# Altium schematic sheet InputAmplifier.SchDoc
size Tabloid; DocumentNumber: 11; SheetNumber: 11; SheetTotal: 11; SheetName: Audio input amplifier; Size: 11x17; Sheet_Name: Audio input amplifier
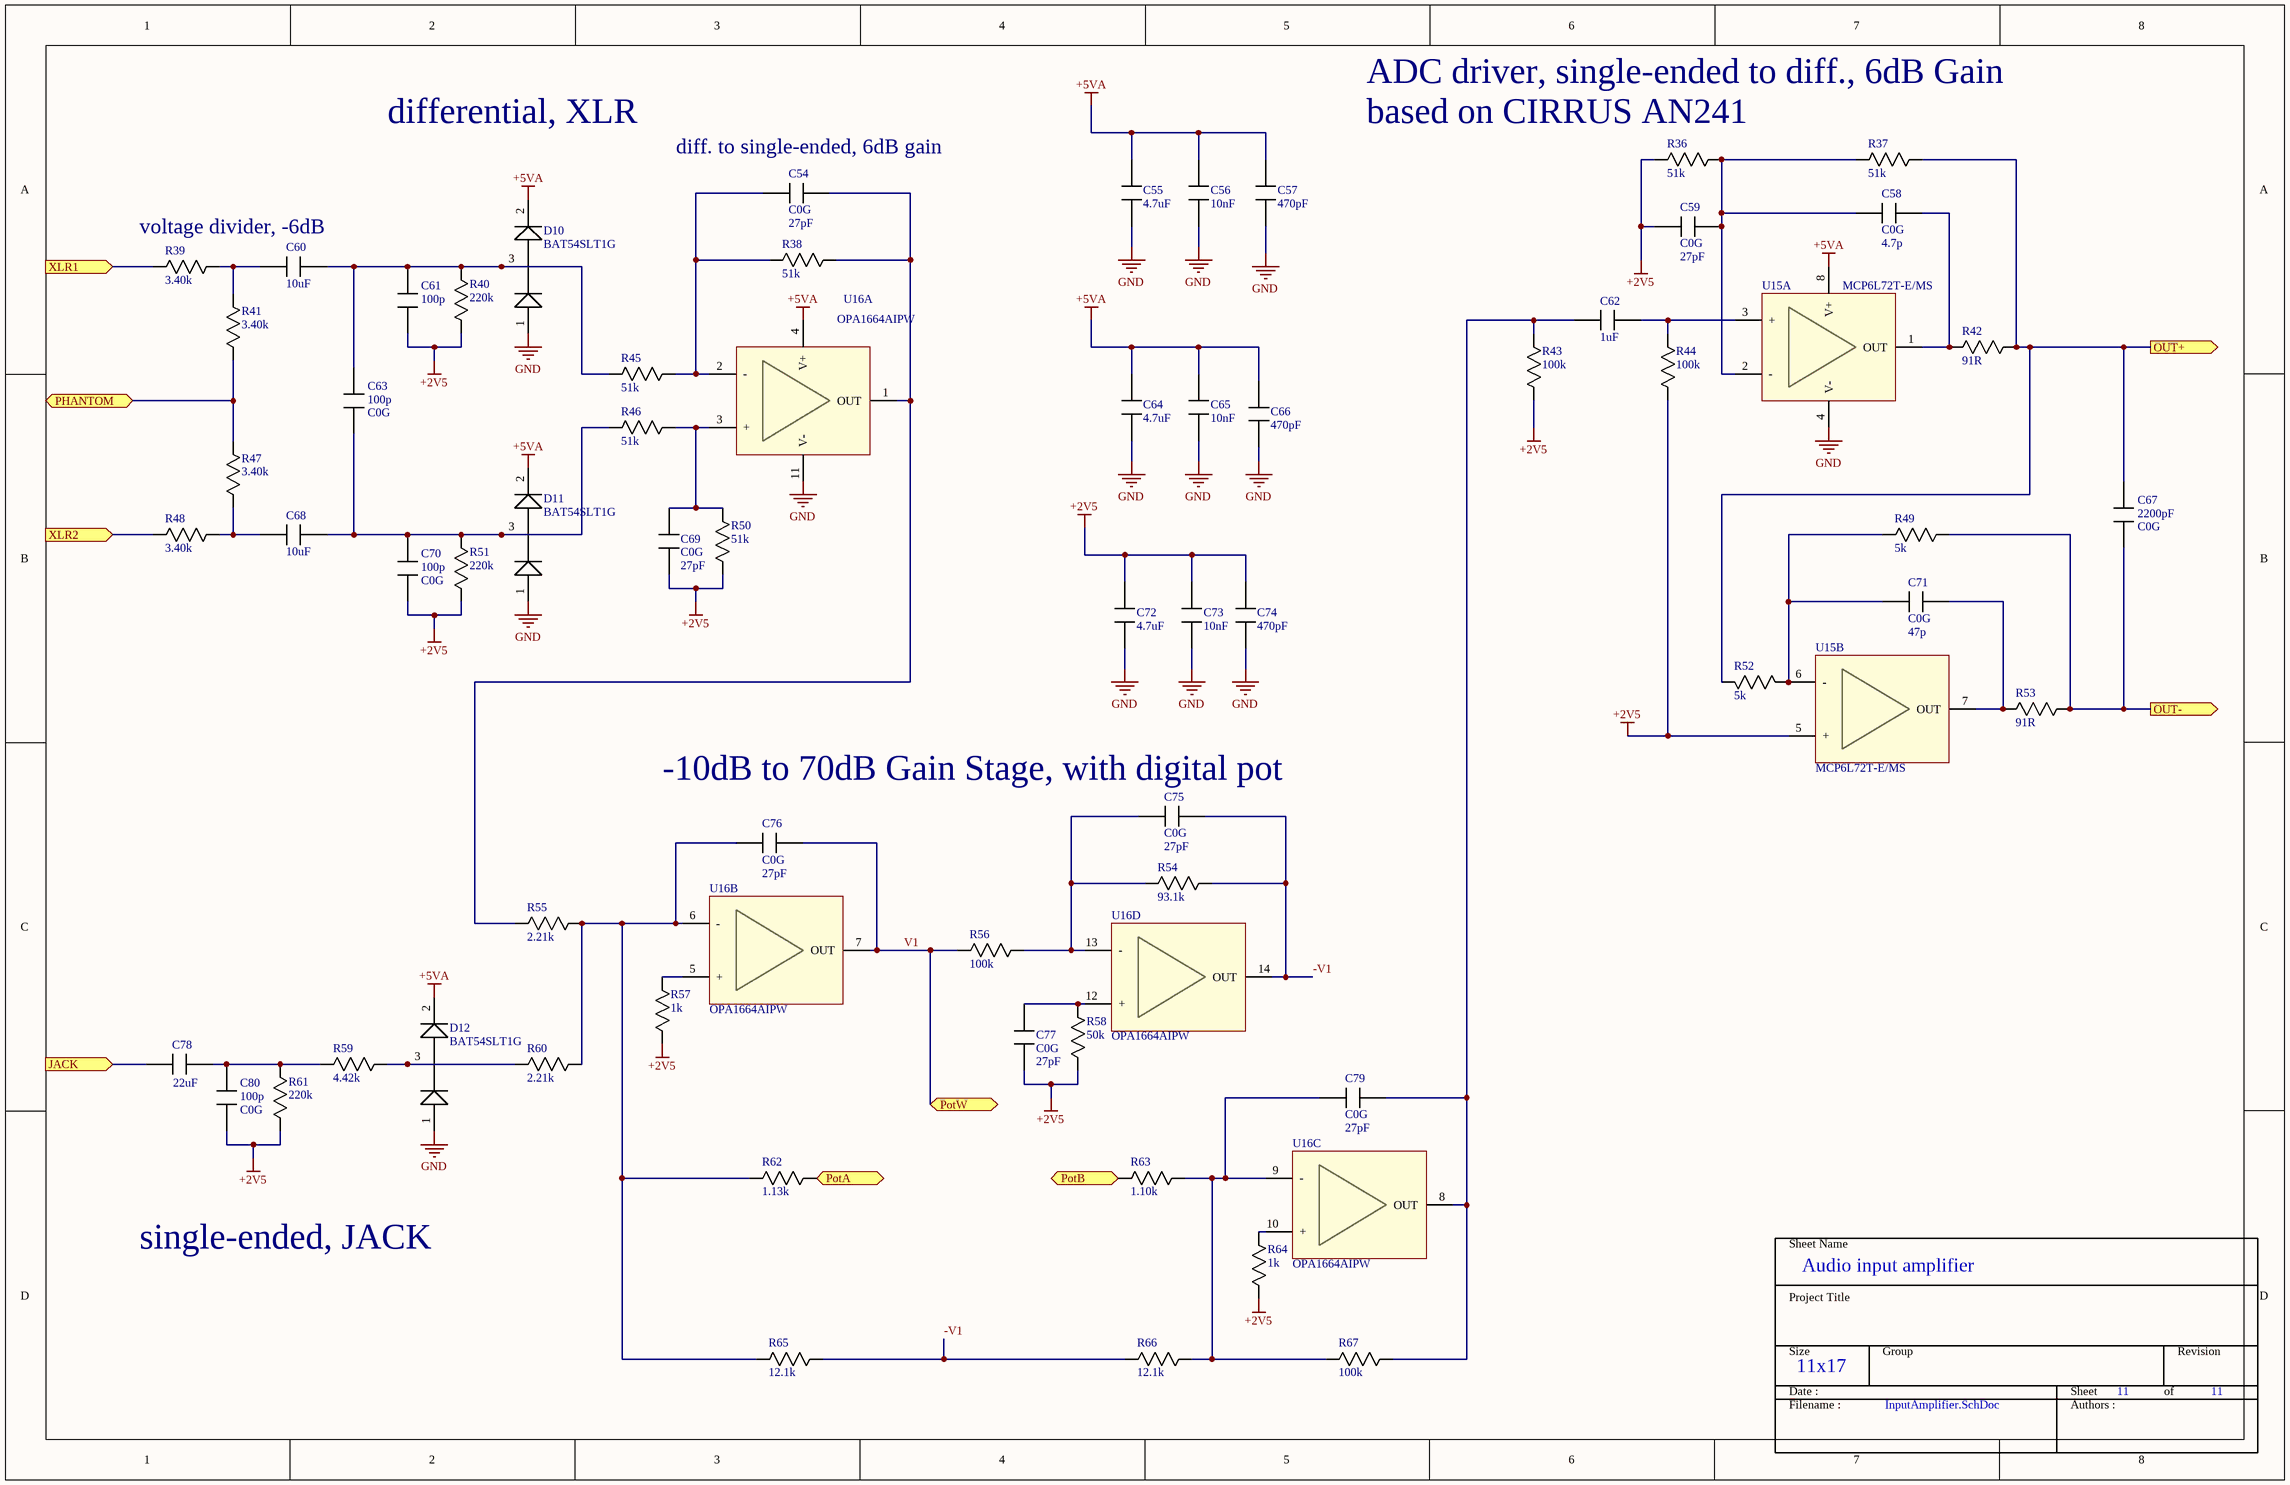
[diagram p0: InputAmplifier.SchDoc]

## Parts
C54  value 27pF  Type: C0G  [0402]  (hidden comment: Capacitor)
C55  value 4.7uF  [0402]  (hidden comment: Capacitor)
C56  value 10nF  [0402]  (hidden comment: Capacitor)
C57  value 470pF  [0402]  (hidden comment: Capacitor)
C58  value 4.7p  Type: C0G  [0402]  (hidden comment: Capacitor)
C59  value 27pF  Type: C0G  [0402]  (hidden comment: Capacitor)
C60  value 10uF  [CAP_1210]  (hidden comment: Capacitor)
C61  value 100p  [0402]  (hidden comment: Capacitor)
C62  value 1uF  [0402]  (hidden comment: Capacitor)
C63  value 100p  Type: C0G  [0402]  (hidden comment: Capacitor)
C64  value 4.7uF  [0402]  (hidden comment: Capacitor)
C65  value 10nF  [0402]  (hidden comment: Capacitor)
C66  value 470pF  [0402]  (hidden comment: Capacitor)
C67  value 2200pF  Type: C0G  [0603]  (hidden comment: Capacitor)
C68  value 10uF  [CAP_1210]  (hidden comment: Capacitor)
C69  value 27pF  Type: C0G  [0402]  (hidden comment: Capacitor)
C70  value 100p  Type: C0G  [0402]  (hidden comment: Capacitor)
C71  value 47p  Type: C0G  [0402]  (hidden comment: Capacitor)
C72  value 4.7uF  [0402]  (hidden comment: Capacitor)
C73  value 10nF  [0402]  (hidden comment: Capacitor)
C74  value 470pF  [0402]  (hidden comment: Capacitor)
C75  value 27pF  Type: C0G  [0402]  (hidden comment: Capacitor)
C76  value 27pF  Type: C0G  [0402]  (hidden comment: Capacitor)
C77  value 27pF  Type: C0G  [0402]  (hidden comment: Capacitor)
C78  value 22uF  [0805]  (hidden comment: Capacitor)
C79  value 27pF  Type: C0G  [0402]  (hidden comment: Capacitor)
C80  value 100p  Type: C0G  [0402]  (hidden comment: Capacitor)
D10  Mfg_PN: BAT54SLT1G  [SOT23_132]  (hidden comment: Diode_dual)
D11  Mfg_PN: BAT54SLT1G  [SOT23_132]  (hidden comment: Diode_dual)
D12  Mfg_PN: BAT54SLT1G  [SOT23_132]  (hidden comment: Diode_dual)
R36  value 51k  [0402]  (hidden comment: Resistor)
R37  value 51k  [0402]  (hidden comment: Resistor)
R38  value 51k  [0402]  (hidden comment: Resistor)
R39  value 3.40k  [0402]  (hidden comment: Resistor)
R40  value 220k  [0402]  (hidden comment: Resistor)
R41  value 3.40k  [0402]  (hidden comment: Resistor)
R42  value 91R  [0402]  (hidden comment: Resistor)
R43  value 100k  [0402]  (hidden comment: Resistor)
R44  value 100k  [0402]  (hidden comment: Resistor)
R45  value 51k  [0402]  (hidden comment: Resistor)
R46  value 51k  [0402]  (hidden comment: Resistor)
R47  value 3.40k  [0402]  (hidden comment: Resistor)
R48  value 3.40k  [0402]  (hidden comment: Resistor)
R49  value 5k  [0402]  (hidden comment: Resistor)
R50  value 51k  [0402]  (hidden comment: Resistor)
R51  value 220k  [0402]  (hidden comment: Resistor)
R52  value 5k  [0402]  (hidden comment: Resistor)
R53  value 91R  [0402]  (hidden comment: Resistor)
R54  value 93.1k  [0402]  (hidden comment: Resistor)
R55  value 2.21k  [0402]  (hidden comment: Resistor)
R56  value 100k  [0402]  (hidden comment: Resistor)
R57  value 1k  [0402]  (hidden comment: Resistor)
R58  value 50k  [0402]  (hidden comment: Resistor)
R59  value 4.42k  [0402]  (hidden comment: Resistor)
R60  value 2.21k  [0402]  (hidden comment: Resistor)
R61  value 220k  [0402]  (hidden comment: Resistor)
R62  value 1.13k  [0402]  (hidden comment: Resistor)
R63  value 1.10k  [0402]  (hidden comment: Resistor)
R64  value 1k  [0402]  (hidden comment: Resistor)
R65  value 12.1k  [0402]  (hidden comment: Resistor)
R66  value 12.1k  [0402]  (hidden comment: Resistor)
R67  value 100k  [0402]  (hidden comment: Resistor)
U15  Mfg_PN: MCP6L72T-E/MS  [SOP127P600-8N]  (hidden comment: OPA_DUAL)  (parts A,B of 2)
U16  Mfg_PN: OPA1664AIPW  [14-TSSOP]  (hidden comment: OPA1664)  (parts A,B,C,D of 4)

## Ports
JACK (in), OUT+ (out), OUT- (out), PHANTOM (bidir), PotA (bidir), PotB (bidir), PotW (bidir), XLR1 (in), XLR2 (in)

## Nets
+2V5: C59.2 C61.2 C69.1 C70.2 C72.1 C73.1 C74.1 C77.1 C80.2 R36.1 R40.2 R43.1 R44.1 R50.2 R51.2 R57.1 R58.2 R61.2 R64.1 U15.5(+)
+5VA: C55.1 C56.1 C57.1 C64.1 C65.1 C66.1 D10.2(K) D11.2(K) D12.2(K) U15.8(V+) U16.4(V+)
GND: C55.2 C56.2 C57.2 C64.2 C65.2 C66.2 C72.2 C73.2 C74.2 D10.1(K) D11.1(K) D12.1(K) U15.4(V-) U16.11(V-)
-V1: C75.2 R54.1 R65.1 R66.2 U16.14(OUT)
JACK: C78.1 ; port JACK
OUT+: C67.1 R37.2 R42.2 R52.2 ; port OUT+
OUT-: C67.2 R49.2 R53.2 ; port OUT-
PHANTOM: R41.2 R47.1 ; port PHANTOM
PotA: R62.1 ; port PotA
PotB: R63.2 ; port PotB
V1: C76.2 R56.1 U16.7(OUT) ; port PotW
XLR1: R39.1 ; port XLR1
XLR2: R48.1 ; port XLR2
NetC54_1: C54.1 R38.2 R45.2 U16.2(-)
NetC54_2: C54.2 R38.1 R55.2 U16.1(OUT)
NetC58_1: C58.1 C59.1 R36.2 R37.1 U15.2(-)
NetC58_2: C58.2 R42.1 U15.1(OUT)
NetC60_1: C60.1 R39.2 R41.1
NetC60_2: C60.2 C61.1 C63.1 D10.3(AK) R40.1 R45.1
NetC62_1: C62.1 C79.2 R43.2 R67.1 U16.8(OUT)
NetC62_2: C62.2 R44.2 U15.3(+)
NetC63_2: C63.2 C68.2 C70.1 D11.3(AK) R46.1 R51.1
NetC68_1: C68.1 R47.2 R48.2
NetC69_2: C69.2 R46.2 R50.1 U16.3(+)
NetC71_1: C71.1 R49.1 R52.1 U15.6(-)
NetC71_2: C71.2 R53.1 U15.7(OUT)
NetC75_1: C75.1 R54.2 R56.2 U16.13(-)
NetC76_1: C76.1 R55.1 R60.1 R62.2 R65.2 U16.6(-)
NetC77_2: C77.2 R58.1 U16.12(+)
NetC78_2: C78.2 C80.1 R59.2 R61.1
NetC79_1: C79.1 R63.1 R66.1 R67.2 U16.9(-)
NetD12_3: D12.3(AK) R59.1 R60.2
NetR57_2: R57.2 U16.5(+)
NetR64_2: R64.2 U16.10(+)

## Notes on the sheet
- ADC driver, single-ended to diff., 6dB Gain
- differential, XLR
- (near C54) diff. to single-ended, 6dB gain
- (near R36) based on CIRRUS AN241
- voltage divider, -6dB
- (near C75) -10dB to 70dB Gain Stage, with digital pot
- single-ended, JACK
- Sheet Name
- Project Title
- Size
- Group
- Revision
- Date :
- Filename :
- Sheet
- Authors :
- of

## Library data of the parts
C54 C58 C59 C69 C71 C75-C77 C79 = Capacitor: Mfg: Samsung; Mfg_PN: CL10C471JB8NCNC; HelpURL: *; NI: *; Supplier1: Digikey; Supplier1_PN: 1276-2302-1-ND; Tolerance: *; Rating: *
C55 C64 C72 = Capacitor: Mfg: Samsung; Mfg_PN: CL05A475MP5NRNC; HelpURL: *; NI: *; Supplier1: Digikey; Supplier1_PN: 1276-1482-1-ND; Tolerance: *; Type: *; Rating: *
C56 C65 C73 = Capacitor: Mfg: Samsung; Mfg_PN: CL05B103KO5NNNC; HelpURL: *; NI: *; Supplier1: Digikey; Supplier1_PN: 1276-1051-1-ND; Tolerance: *; Type: *; Rating: *
C57 C61 C66 C74 = Capacitor: Mfg: Murata; Mfg_PN: GRM155R71H471KA01D; HelpURL: *; NI: *; Supplier1: Digikey; Supplier1_PN: 490-1300-1-ND; Tolerance: *; Rating: *
  C57 C66 C74: Type: *
C60 C68 = Capacitor: Mfg: Samsung; Mfg_PN: CL32B106KMVNNWE; HelpURL: https://www.digikey.ca/product-detail/en/samsung-electro-mechanics/CL32B106KMVNNWE/1276-7053-1-ND/7320695; NI: NI; Supplier1: Digikey; Supplier1_PN: 1276-7053-1-ND; Tolerance: *; Type: *; Rating: *
C62 = Capacitor: Mfg: Samsung Electro-Mechanics; Mfg_PN: CL05A105MP5NNNC; HelpURL: *; NI: *; Supplier1: Digikey; Supplier1_PN: 1276-1448-1-ND; Tolerance: *; Type: *; Rating: *
C63 C70 C80 = Capacitor: Mfg: Yageo; Mfg_PN: CC0402JRNPO9BN101; HelpURL: *; NI: *; Supplier1: Digikey; Supplier1_PN: 311-1024-1-ND; Tolerance: *; Rating: *
C67 = Capacitor: Mfg: Murata; Mfg_PN: GRM1885C1H222JA01D; HelpURL: *; NI: *; Supplier1: Digikey; Supplier1_PN: 490-1459-1-ND; Tolerance: *; Rating: *
C78 = Capacitor: Mfg: Samsung Electro-Mechanics; Mfg_PN: CL21A226MOCLRNC; HelpURL: *; NI: *; Supplier1: Digikey; Supplier1_PN: 1276-6780-1-ND; Tolerance: *; Rating: *
D10-D12 = Diode_dual: Diode; Mfg: Onsemi; HelpURL: *; NI: *; Supplier1: Digikey; Supplier1_PN: BAT54SLT1GOSCT-ND; Tolerance: *; Type: *; Rating: *; Value: *
R36 R37 R49 R52 = Resistor: Mfg: Yageo; Mfg_PN: RC0603FR-07634RL; HelpURL: *; NI: *; Supplier1: Digikey; Supplier1_PN: 311-634HRCT-ND; Type: *; Rating: *; Tolerance: *
R38-R41 R43-R48 R50 R51 R54-R67 = Resistor: Mfg: Yageo; Mfg_PN: 311-10GRCT-ND; HelpURL: *; NI: *; Supplier1: Digikey; Supplier1_PN: 311-100KGRCT-ND; Type: *; Rating: *; Tolerance: *
R42 R53 = Resistor: Mfg: Yageo; Mfg_PN: RC0603JR-0791RL; HelpURL: *; NI: *; Supplier1: Digikey; Supplier1_PN: 311-91GRCT-ND; Type: *; Rating: *; Tolerance: *
U15 = OPA_DUAL: Dual amplifier (standard); Mfg: Microchip; HelpURL: *; NI: *; Rating: *; Supplier1: Digikey; Supplier1_PN: MCP6L72T-E/MSCT-ND; Tolerance: *; Value: *
U16 = OPA1664: Quad amplifier (audio); Mfg: Texas Instruments; HelpURL: *; NI: *; Rating: *; Supplier1: Digikey; Supplier1_PN: 296-34981-ND; Tolerance: *; Value: *